# EAGLE design GPS_Board_v0.1 (EAGLE 7.7.0)
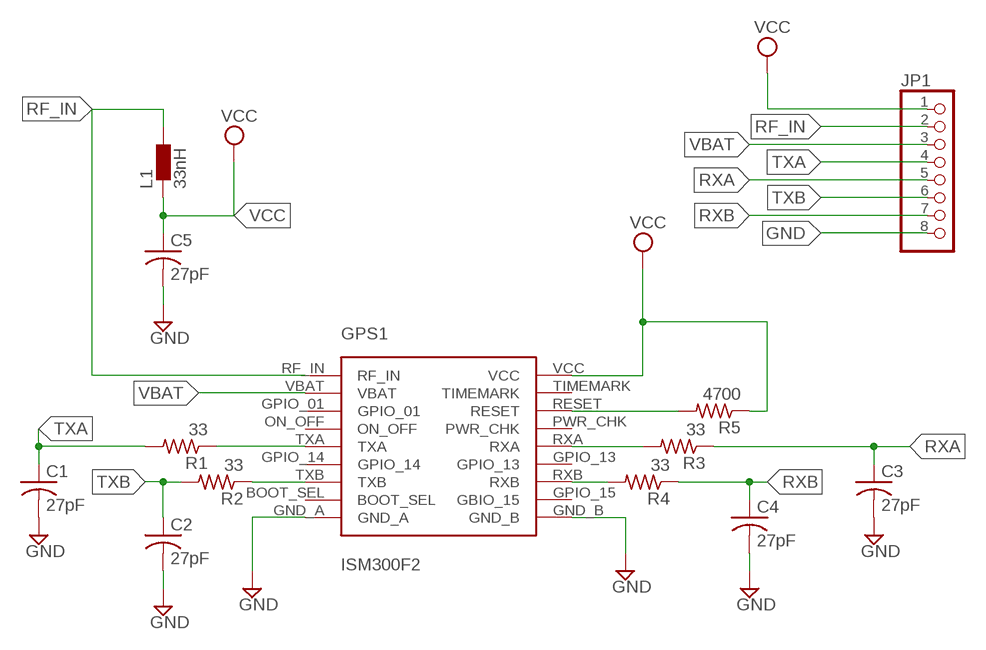
[diagram p0: schematic, sheet 1]

## Parts
C1  27pF  C-USC0805K  [C0805K]
C2  27pF  C-USC0805K  [C0805K]
C3  27pF  C-USC0805K  [C0805K]
C4  27pF  C-USC0805K  [C0805K]
C5  27pF  C-USC0805K  [C0805K]
GPS1  ISM300F2  [ISM300F2]
JP1  PINHD-1X8BIG  [1X08-BIG]
L1  33nH  LL4532P  [L4532P]
R1  33  R-US_R0805  [R0805]
R2  33  R-US_R0805  [R0805]
R3  33  R-US_R0805  [R0805]
R4  33  R-US_R0805  [R0805]
R5  4700  R-US_R0805  [R0805]

## Nets
GND: C1.2 C2.2 C3.2 C4.2 C5.2 GPS1.GND_A GPS1.GND_B JP1.8
N$1: GPS1.RESET R5.2
N$2: GPS1.TXB R2.1
N$3: GPS1.TXA R1.1
N$5: GPS1.RXB R4.2
N$7: GPS1.RXA R3.2
RF_IN: GPS1.RF_IN JP1.2 L1.1
RXA: C3.1 JP1.5 R3.1
RXB: C4.1 JP1.7 R4.1
TXA: C1.1 JP1.4 R1.2
TXB: C2.1 JP1.6 R2.2
VBAT: GPS1.VBAT JP1.3
VCC: C5.1 GPS1.VCC JP1.1 L1.2 R5.1
Unconnected: GPS1.BOOT_SEL GPS1.GPIO_01 GPS1.GPIO_13 GPS1.GPIO_14 GPS1.GPIO_15(GBIO_15) GPS1.ON_OFF GPS1.PWR_CHK GPS1.TIMEMARK

## Library data of the parts
C1-C5 = adafruit:C-US: CAPACITOR, American symbol; MPN: C0805C270J5GACTU; OC_NEWARK: 36X2729
GPS1 = ISM300F2:ISM300F2; OC_NEWARK: unknown
JP1 = adafruit:PINHD-1X8: PIN HEADER; OC_NEWARK: unknown
L1 = eagle-ltspice:L: INDUCTOR, European symbol; MPN: MCWL06KT33N; OC_NEWARK: 20T1101; SPICEMODEL: NONE; SPICEPREFIX: L
R1-R4 = adafruit:R-US_: RESISTOR, American symbol; MF: VISHAY/DALE; MPN: CRCW120633R2FKEA; OC_NEWARK: 42K4999
R5 = adafruit:R-US_: RESISTOR, American symbol; MF: VISHAY/DALE; MPN: CRCW12104K70FKEA; OC_NEWARK: 53K3253

## Net classes
0 default: width 0.305 mm, drill 0.508 mm, clearance 0.508 mm

## Board
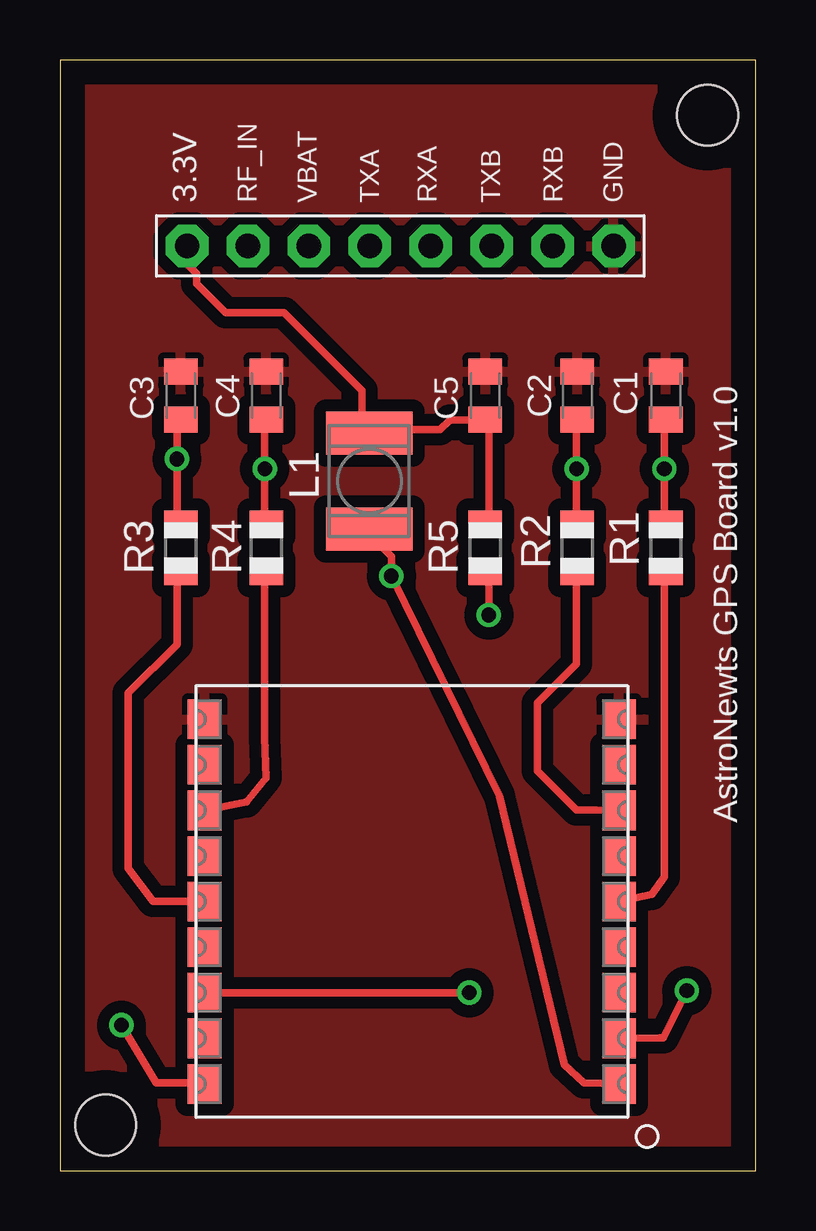
[diagram p1: board, top side]
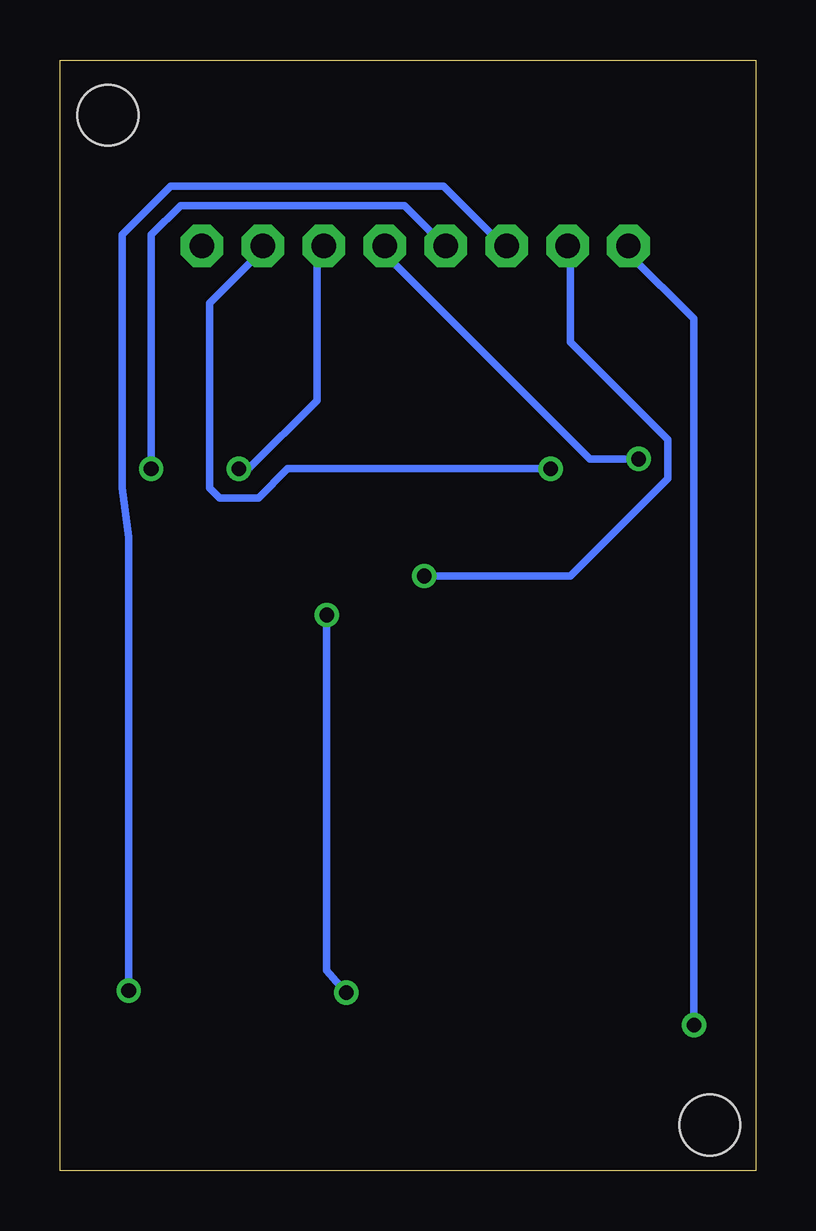
[diagram p2: board, bottom side, seen from below]

Size 29 x 46.3 mm. Coordinates in mm from the lower left corner, seen from the top.
Outline: 0,0 29,0 29,46.3 0,46.3 0,0
Copper layers (1*16): Top 0.035mm / dielectric 1.5mm / Bottom 0.035mm
Design rules "default": minimum track width 10mil, minimum drill 24mil, track to track 8mil, track to pad 8mil, pad to pad 8mil, via to via 8mil, smd to smd 8mil, copper to edge 40mil, drill to drill 8mil, minimum pad ring 10mil, minimum via ring 8mil, stop-mask expansion 4mil, vias tented up to drill 0mil, thermal gap 10mil
Holes 2.54 mm at 1.91,1.91 27,44

### Footprints (pad centres in the part's own frame; a part is rotated, then mirrored left to right if it is on the bottom)
C0805K = smd 1.1 x 1.4: 1 -1,0; 2 1,0
ISM300F2 = smd 1.4 x 1.65: BOOT_SEL -8.637,-5.7; GND_A -8.637,-7.6; GND_B 8.637,-7.6; GPIO_01 -8.637,3.8; GPIO_13 8.637,-1.9; GPIO_14 -8.637,-1.9; GPIO_15 8.637,-5.7; ON_OFF -8.637,1.9; PWR_CHK 8.637,1.9; RESET 8.637,3.8; RF_IN -8.637,7.6; RXA 8.637,0; RXB 8.637,-3.8; TIMEMARK 8.637,5.7; TXA -8.637,0; TXB -8.637,-3.8; VBAT -8.637,5.7; VCC 8.637,7.6
1X08-BIG = drill 1.016 pad 1.778 octagon: 1 -8.89,0; 2 -6.35,0; 3 -3.81,0; 4 -1.27,0; 5 1.27,0; 6 3.81,0; 7 6.35,0; 8 8.89,0
L4532P = smd 1.8 x 3.6: 1 -2,0; 2 2,0
R0805 = smd 1.1 x 1.4: 1 -1,0; 2 1,0

### Placement (x,y rotation side)
C1  25.26,32.31 90 top
C2  21.57,32.31 90 top
C3  5.04,32.31 90 top
C4  8.6,32.31 90 top
C5  17.73,32.31 90 top
GPS1  14.67,11.22 180 top
JP1  14.19,38.55 0 top
L1  12.9,28.75 90 top
R1  25.26,25.96 90 top
R2  21.57,25.96 90 top
R3  5.04,25.96 270 top
R4  8.6,25.96 270 top
R5  17.73,25.96 270 top

### Tracks (layer width: path | path; a pad name or v marks a point on that pad's centre or on a via)
GND
  pour Top: 0.2,45.8 28.5,45.8 28.5,0.2 0.2,0.2
N$1  (via drill 0.61)
  Top 0.305: v17.88,23.16 17.88,24.79 R5.2 | GPS1.RESET v17.07,7.42
  Bottom 0.305: v17.88,23.16 17.88,8.35 v17.07,7.42
N$2
  Top 0.305: R2.1 21.54,24.79 21.54,21.13 19.91,19.51 19.91,16.66 21.54,15.04 22.35,15.04 GPS1.TXB
N$3
  Top 0.305: R1.1 25.2,24.79 25.2,12.26 24.68,11.51 GPS1.TXA
N$5
  Top 0.305: R4.2 8.53,24.79 8.53,18.07 8.6,16.38 7.78,15.38 GPS1.RXB
N$7
  Top 0.305: 5.05,24.57 R3.2 4.88,24.79 4.88,21.95 2.85,19.91 2.85,12.6 3.88,11.22 GPS1.RXA
RF_IN  (via drill 0.61)
  Top 0.305: GPS1.RF_IN 21.85,3.66 21.04,4.41 18.32,15.63 v13.82,24.79 13.82,25.6 13.01,26.42 L1.1
  Bottom 0.305: v13.82,24.79 7.72,24.79 3.66,28.85 3.66,30.48 7.72,34.54 7.72,38.2 JP1.2
RXA  (via drill 0.61)
  Top 0.305: R3.1 4.88,27.23 v4.88,29.67 4.88,31.29 C3.1
  Bottom 0.305: v4.88,29.67 6.91,29.67 15.44,38.2 JP1.5
RXB  (via drill 0.61)
  Top 0.305: 8.46,27.01 R4.1 8.53,27.23 v8.53,29.26 8.53,31.29 C4.1 8.46,31.07
  Bottom 0.305: v8.53,29.26 19.51,29.26 20.73,28.04 22.35,28.04 22.76,28.45 22.76,36.17 20.73,38.2 JP1.7
TXA  (via drill 0.61)
  Top 0.305: R1.2 25.2,27.23 v25.2,29.26 25.2,31.29 C1.1
  Bottom 0.305: v25.2,29.26 25.2,39.01 23.98,40.23 14.63,40.23 13.01,38.61 JP1.4
TXB  (via drill 0.61)
  Top 0.305: R2.2 21.54,27.23 v21.54,29.26 21.54,31.29 C2.1
  Bottom 0.305: v21.54,29.26 21.13,29.26 18.29,32.11 18.29,38.2 JP1.6
VBAT  (via drill 0.61)
  Top 0.305: v26.13,7.5 25.16,5.53 25.01,5.53 GPS1.VBAT
  Bottom 0.305: v26.13,7.5 26.13,26.42 26.42,28.45 26.42,39.01 24.38,41.05 13.01,41.05 10.57,38.61 JP1.3
VCC  (via drill 0.61)
  Top 0.305: 17.89,27.01 R5.1 17.88,27.23 17.88,31.29 C5.1 | 17.49,31.07 C5.1 | C5.1 17.48,31.29 16.26,31.29 15.85,30.89 13.01,30.89 L1.2 12.6,30.89 12.6,32.51 9.35,35.76 6.91,35.76 5.69,36.98 5.69,37.39 4.88,38.2 5.28,38.61 JP1.1 | v2.56,6.07 4,3.66 5.28,3.66 GPS1.VCC
  Bottom 0.305: v2.56,6.07 2.56,35.51 5.28,38.2 JP1.1

### Text on the board
tPlace: 3.3V | RF_IN | VBAT | TXA | RXA | TXB | RXB | GND | AstroNewts GPS Board v1.0